# Altium schematic sheet DSP_Board_Headers.SchDoc
size Letter
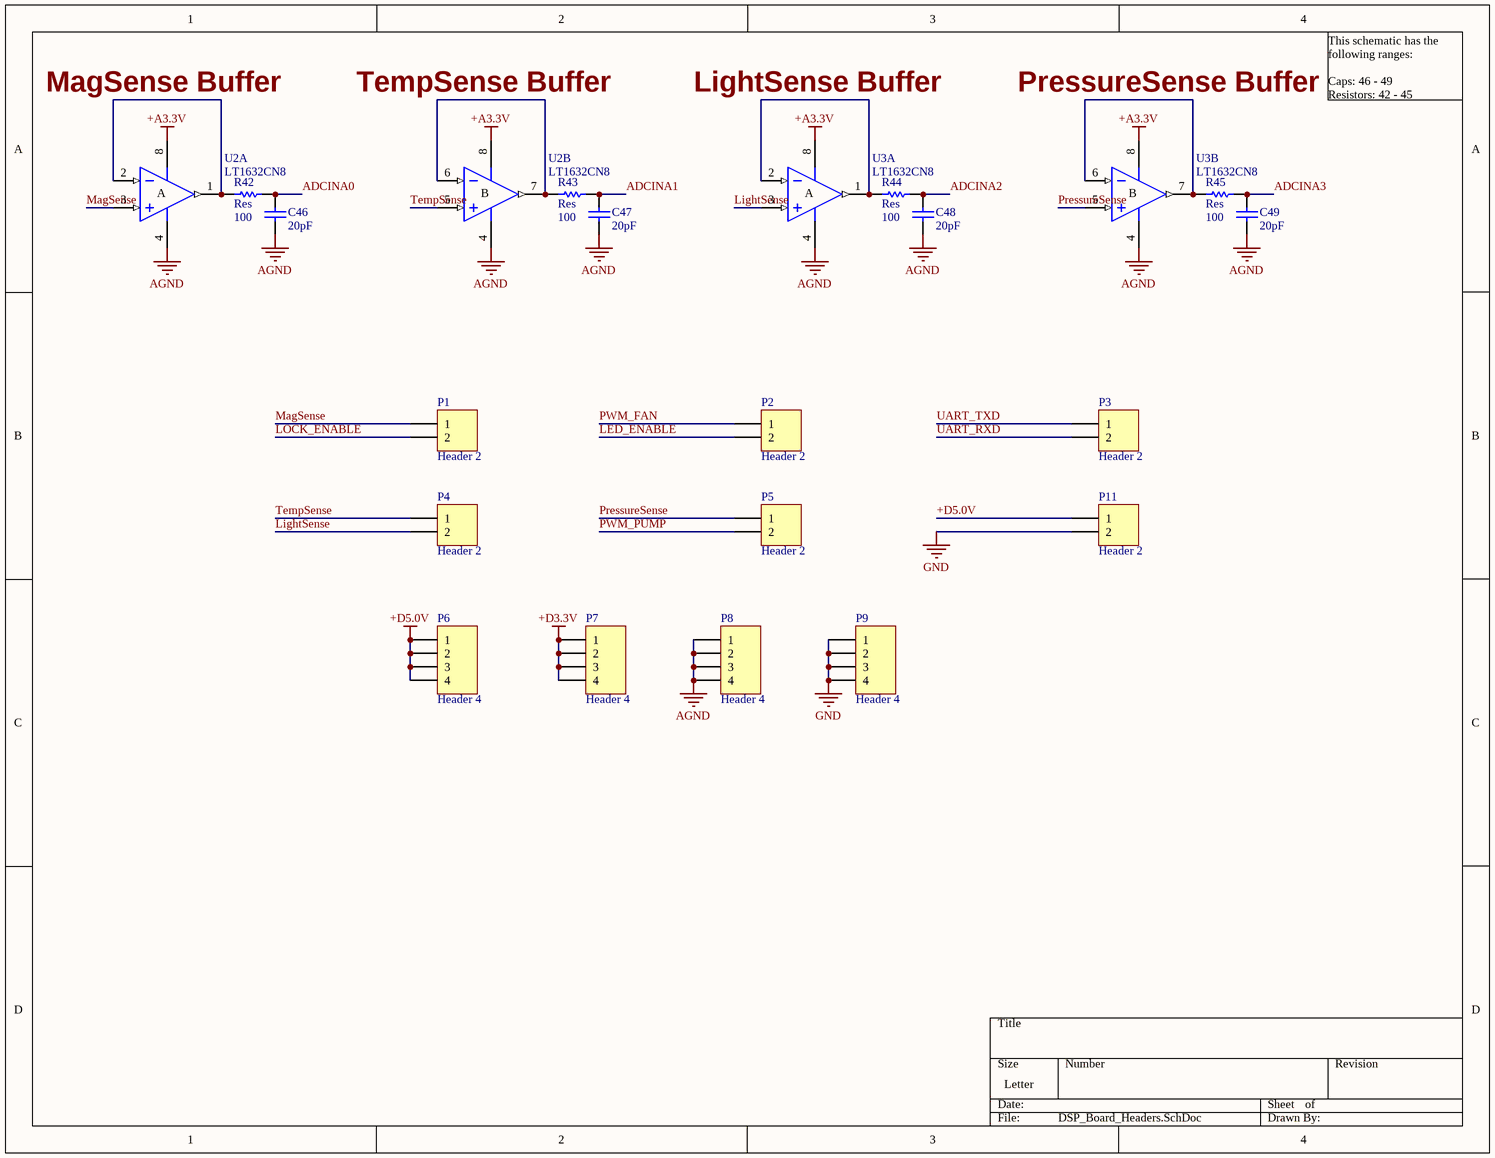
[diagram p0: DSP_Board_Headers.SchDoc]

## Parts
C46  value 20pF  [0805]  (hidden comment: Cap Semi)
C47  value 20pF  [0805]  (hidden comment: Cap Semi)
C48  value 20pF  [0805]  (hidden comment: Cap Semi)
C49  value 20pF  [0805]  (hidden comment: Cap Semi)
P1  Header 2  [HDR1X2]
P2  Header 2  [HDR1X2]
P3  Header 2  [HDR1X2]
P4  Header 2  [HDR1X2]
P5  Header 2  [HDR1X2]
P6  Header 4  [HDR1X4]
P7  Header 4  [HDR1X4]
P8  Header 4  [HDR1X4]
P9  Header 4  [HDR1X4]
P11  Header 2  [HDR1X2]
R42  Res  value 100  [0805]
R43  Res  value 100  [0805]
R44  Res  value 100  [0805]
R45  Res  value 100  [0805]
U2  LT1632CN8  [DIP-8]  (parts A,B of 2)
U3  LT1632CN8  [DIP-8]  (parts A,B of 2)

## Nets
+A3.3V: U2.8(V+) U3.8(V+)
+D3.3V: P7.1 P7.2 P7.3 P7.4
+D5.0V: P6.1 P6.2 P6.3 P6.4 P11.1
AGND: C46.1 C47.1 C48.1 C49.1 P8.1 P8.2 P8.3 P8.4 U2.4(V-) U3.4(V-)
GND: P9.1 P9.2 P9.3 P9.4 P11.2
ADCINA0: C46.2 R42.2
ADCINA1: C47.2 R43.2
ADCINA2: C48.2 R44.2
ADCINA3: C49.2 R45.2
LED_ENABLE: P2.2
LightSense: P4.2 U3.3(IN+)
LOCK_ENABLE: P1.2
MagSense: P1.1 U2.3(IN+)
PressureSense: P5.1 U3.5(IN+)
PWM_FAN: P2.1
PWM_PUMP: P5.2
TempSense: P4.1 U2.5(IN+)
UART_RXD: P3.2
UART_TXD: P3.1
NetR42_1: R42.1 U2.1(OUT) U2.2(IN-)
NetR43_1: R43.1 U2.6(IN-) U2.7(OUT)
NetR44_1: R44.1 U3.1(OUT) U3.2(IN-)
NetR45_1: R45.1 U3.6(IN-) U3.7(OUT)

## Notes on the sheet
- MagSense Buffer
- TempSense Buffer
- LightSense Buffer
- PressureSense Buffer
- This schematic has the following ranges:
  Caps: 46 - 49
  Resistors: 42 - 45
- (in symbol LT1632CN8, part A) A
- (in symbol LT1632CN8, part B) B

## Library data of the parts
C46-C49 = Cap Semi: Capacitor (Semiconductor SIM Model); Published: 8-Jun-2000; LatestRevisionDate: 17-Jul-2002; LatestRevisionNote: Re-released for DXP Platform.; PackageReference: C1206; Publisher: Altium Limited
P1-P5 P11 = Header 2: Header, 2-Pin; LatestRevisionDate: 17-Jul-2002; LatestRevisionNote: Re-released for DXP Platform.; Publisher: Altium Limited
P6-P9 = Header 4: Header, 4-Pin; LatestRevisionDate: 17-Jul-2002; LatestRevisionNote: Re-released for DXP Platform.; Publisher: Altium Limited
R42-R45 = Res Semi: Semiconductor Resistor; Published: 8-Jun-2000; LatestRevisionDate: 17-Jul-2002; LatestRevisionNote: Re-released for DXP Platform.; PackageReference: AXIAL-0.5; Publisher: Altium Limited
U2 U3 = LT1632CN8: 45MHz, 45V/µs, Dual Rail-to-Rail Input and Output Precision Operational Amplifier; Note: 1455; Published: 8-Jun-2000; LatestRevisionDate: 29-May-2009; LatestRevisionNote: Component Body Added.; DatasheetVersion: 1996; PackageVersion: N8 1002; PackageReference: N8; Publisher: Altium Limited; PackageDescription: DIP, Plastic, 8-Pin, Row Spacing 7.62 mm, Pitch 2.54 mm; ComponentLink1Description: Manufacturer Link; ComponentLink1URL: http://www.linear.com/; ComponentLink2Description: Datasheet; ComponentLink2URL: http://www.linear.com/pc/downloadDocument.do?navId=H0,C1,C1154,C1009,C1022,P1642,D3055